# EAGLE board io-board-d-8 (EAGLE 8.4.3), part 1 of 2
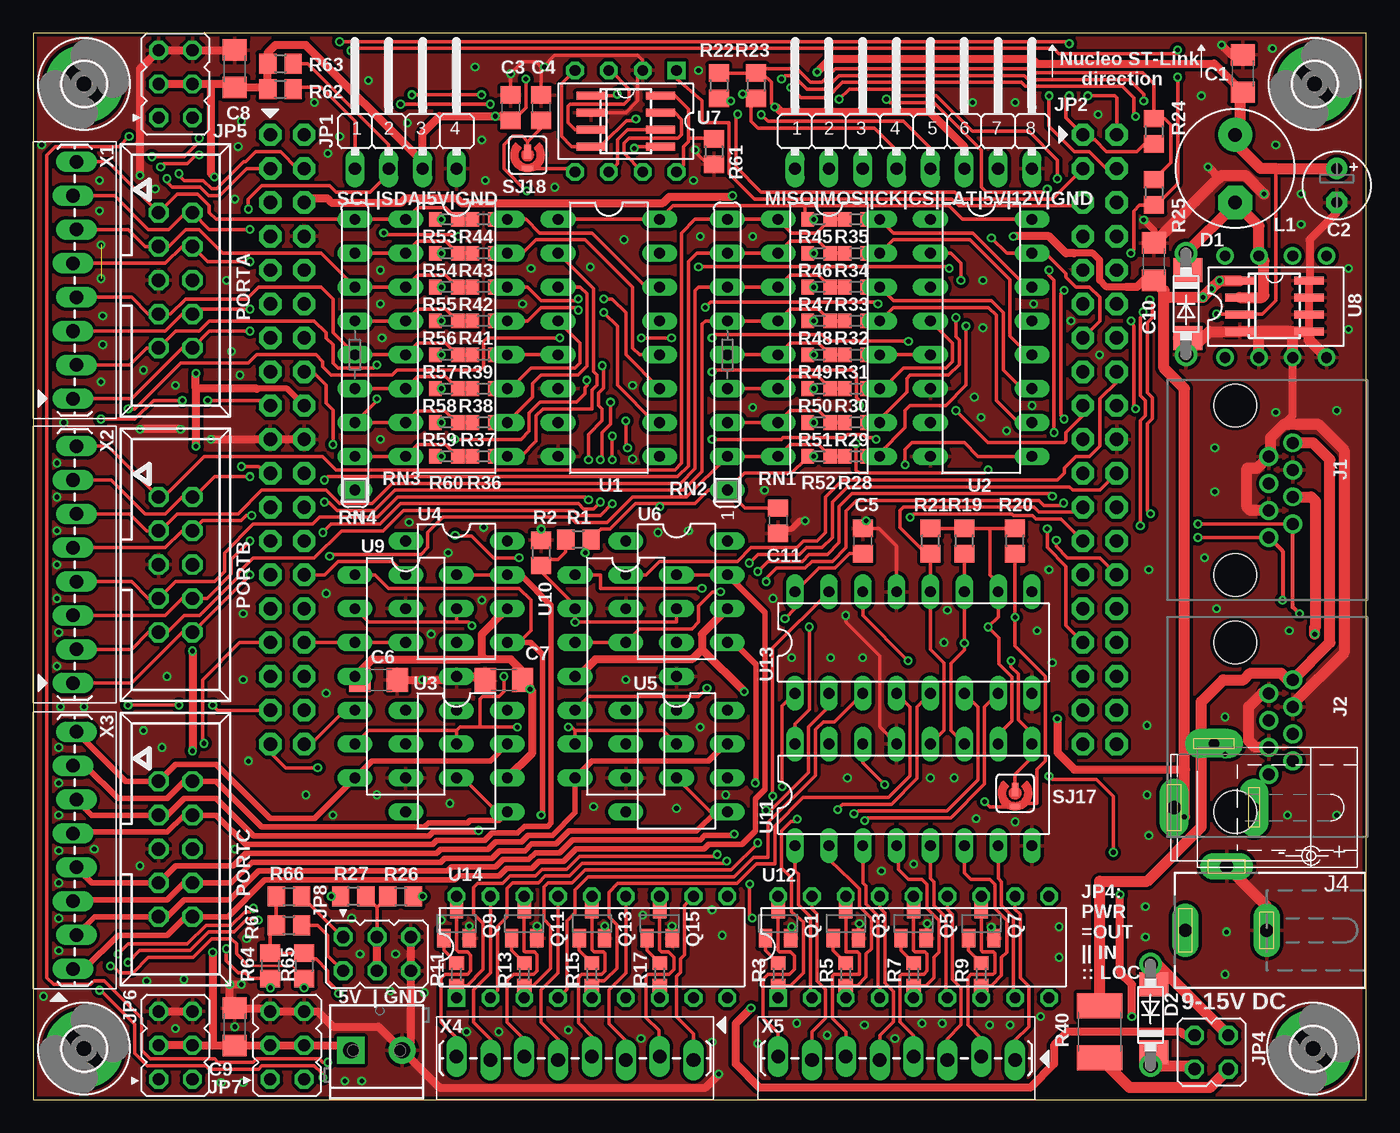
[diagram p5: board, top side]
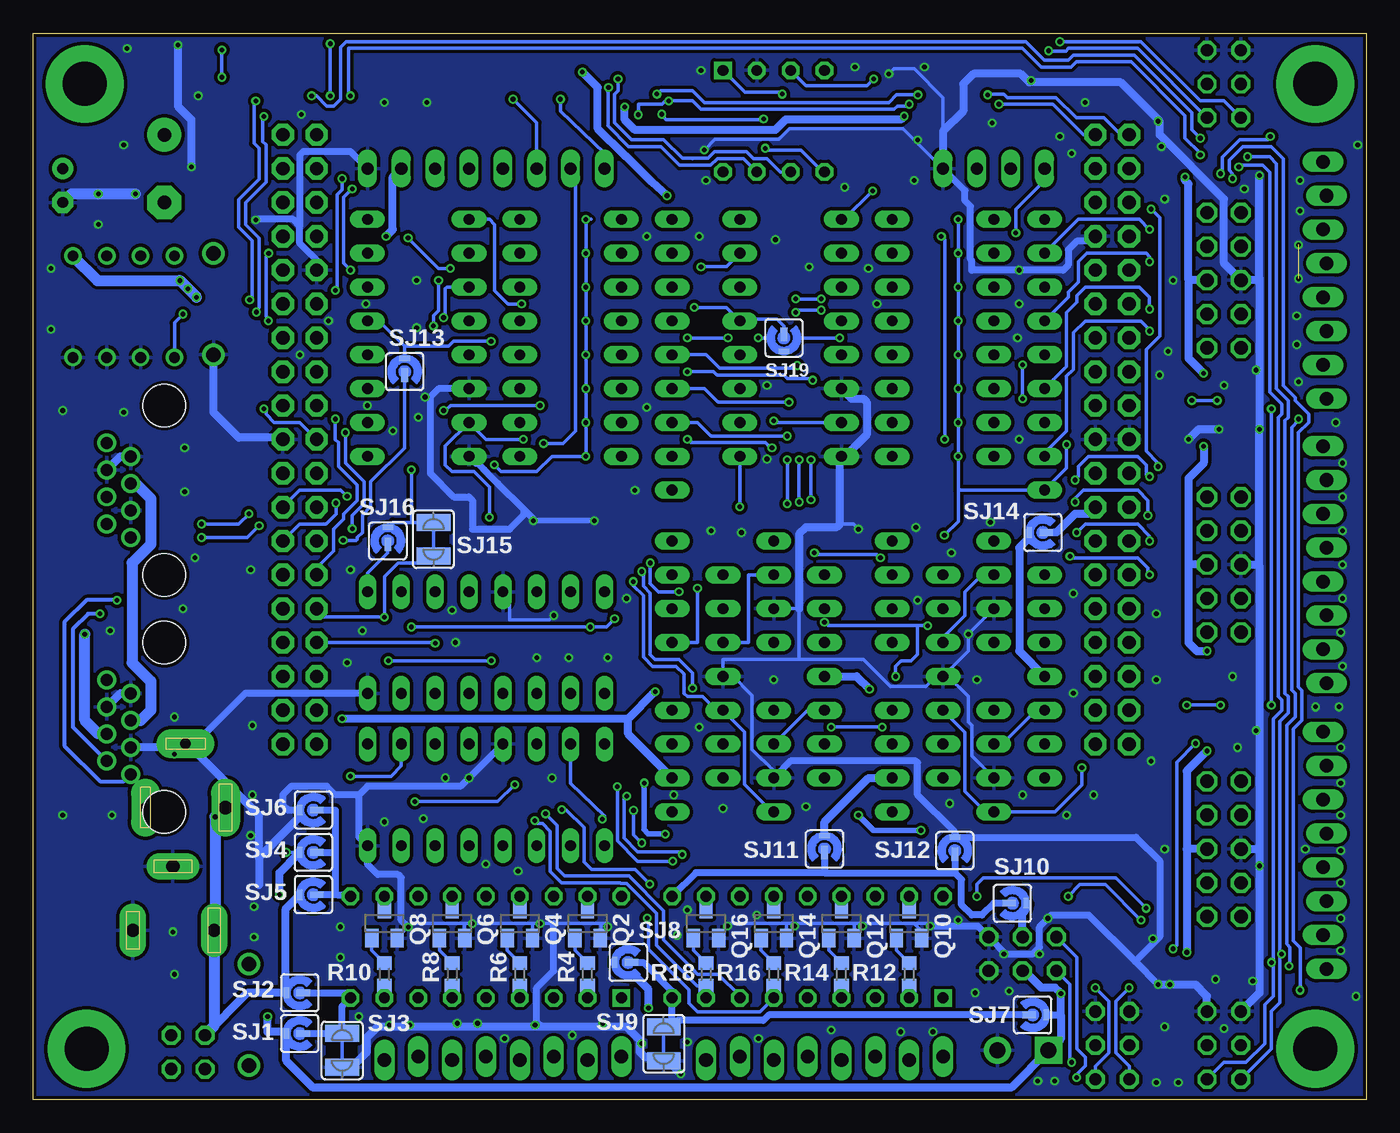
[diagram p6: board, bottom side, seen from below]

Size 100 x 80 mm. Coordinates in mm from the lower left corner, seen from the top.
Outline: 0,0 100,0 100,80 0,80 0,0
Copper layers (1*16): Top 0.035mm / dielectric 1.5mm / Bottom 0.035mm
Design rules "SeeedStudio_2layer_DRU_no_angle_20140221 *": minimum track width 6mil, minimum drill 12mil, track to track 10mil, track to pad 7mil, pad to pad 16mil, via to via 6mil, smd to smd 0mil, copper to edge 10mil, drill to drill 10mil, minimum pad ring 10mil, minimum via ring 6mil, stop-mask expansion 2mil, vias tented up to drill 100mil, thermal gap 10mil

## Footprints (pad centres in the part's own frame; a part is rotated, then mirrored left to right if it is on the bottom)
C1206 = smd 1.6 x 1.8: 1 -1.4,0; 2 1.4,0
E2,5-5 = drill 0.813 pad 1.6: + -1.27,0 | drill 0.813 pad 1.6 octagon: - 1.27,0
C0805 = smd 1.3 x 1.5: 1 -0.95,0; 2 0.95,0
DO41-7.6 = drill 1.1 pad 1.7: A 3.81,0; C -3.81,0
DO214AA-NODOC = smd 1.8 x 2.2: A 2.55,0; C -2.55,0
3,3-PAD = drill 3.3 pad 5.842: B3,3 0,0
RJ45-PULSE-E5J88 = drill 0.9 pad 1.422: 1 3.555,2.54; 2 2.535,4.32; 3 1.515,2.54; 4 0.495,4.32; 5 -0.495,2.54; 6 -1.515,4.32; 7 -2.535,2.54; 8 -3.555,4.32 | hole 3.2: 6.35,0; -6.35,0
DCJ0202 = drill 1 pad 2 long: 1 0,3.1; 2 4.8,0; 3 0,-3
SPC4077 = drill 0.8 pad 2.184 long: 1 -3,0; 2 0,-4.8 | drill 1 pad 2.184 long: 3 3,0
JP4F = drill 0.914 long: 1 -2.54,-1.27; 2 0,-1.27; 3 2.54,-1.27; 4 5.08,-1.27
JP8F = drill 0.914 long: 1 -8.89,0; 2 -6.35,0; 3 -3.81,0; 4 -1.27,0; 5 1.27,0; 6 3.81,0; 7 6.35,0; 8 8.89,0
JP2Q = drill 0.914 octagon: 1 -1.27,-1.27; 2 -1.27,1.27; 3 1.27,-1.27; 4 1.27,1.27
JP3Q = drill 0.914 octagon: 1 -2.54,-1.27; 2 -2.54,1.27; 3 0,-1.27; 4 0,1.27; 5 2.54,-1.27; 6 2.54,1.27
L5-8,5 = drill 1.016 pad 2.54: 1 -2.54,0 | drill 1.016 pad 2.54 octagon: 2 2.54,0
CON10M = drill 1 octagon: 1 -5.08,-1.27; 2 -5.08,1.27; 3 -2.54,-1.27; 4 -2.54,1.27; 5 0,-1.27; 6 0,1.27; 7 2.54,-1.27; 8 2.54,1.27; 9 5.08,-1.27; 10 5.08,1.27
SOT23 = smd 1 x 1.4: 1 -0.95,-1.1; 2 0.95,-1.1; 3 0,1.1
R0805 = smd 1.3 x 1.5: 1 -0.95,0; 2 0.95,0
R0603 = smd 1 x 1.1: 1 -0.85,0; 2 0.85,0
PTC1812 = smd 1.9 x 3.4: 1 -1.95,0; 2 1.95,0
R0603' = smd 0.95 x 1.1: 1 -0.825,0 | smd 1 x 1.1: 2 0.85,0
DIL16 = drill 0.813 long: 1 -8.89,-3.81; 2 -6.35,-3.81; 3 -3.81,-3.81; 4 -1.27,-3.81; 5 1.27,-3.81; 6 3.81,-3.81; 7 6.35,-3.81; 8 8.89,-3.81; 9 8.89,3.81; 10 6.35,3.81; 11 3.81,3.81; 12 1.27,3.81; 13 -1.27,3.81; 14 -3.81,3.81; 15 -6.35,3.81; 16 -8.89,3.81
SIL9 = drill 0.813 long: 1 -10.16,0; 2 -7.62,0; 3 -5.08,0; 4 -2.54,0; 5 0,0; 6 2.54,0; 7 5.08,0; 8 7.62,0; 9 10.16,0
SJ_RND2 = smd 1.016 x 0.508: P$1 -0.254,0 | smd 0.406 x 0.813: P$2 1.016,0
SJW-C = smd 1.27 x 2.54: 1 -1.27,0; 2 1.27,0
DIL08-LONG = drill 0.813 long: 1 -3.81,-3.81; 2 -1.27,-3.81; 3 1.27,-3.81; 4 3.81,-3.81; 5 3.81,3.81; 6 1.27,3.81; 7 -1.27,3.81; 8 -3.81,3.81
DIL08 = drill 0.813 square: 1 -3.81,-3.81 | drill 0.813 octagon: 2 -1.27,-3.81; 3 1.27,-3.81; 4 3.81,-3.81; 5 3.81,3.81; 6 1.27,3.81; 7 -1.27,3.81; 8 -3.81,3.81
SO-08 = smd 0.6 x 2.2: 1 -1.905,-2.6; 2 -0.635,-2.6; 3 0.635,-2.6; 4 1.905,-2.6; 5 1.905,2.6; 6 0.635,2.6; 7 -0.635,2.6; 8 -1.905,2.6
DIL08' = drill 0.813 pad 1.27: 1 -3.81,-3.81; 2 -1.27,-3.81; 3 1.27,-3.81; 4 3.81,-3.81; 5 3.81,3.81; 6 1.27,3.81; 7 -1.27,3.81; 8 -3.81,3.81
DIL14 = drill 0.813 long: 1 -7.62,-3.81; 2 -5.08,-3.81; 3 -2.54,-3.81; 4 0,-3.81; 5 2.54,-3.81; 6 5.08,-3.81; 7 7.62,-3.81; 8 7.62,3.81; 9 5.08,3.81; 10 2.54,3.81; 11 0,3.81; 12 -2.54,3.81; 13 -5.08,3.81; 14 -7.62,3.81
DIL18-THIN = drill 0.813 square: 1 -10.16,-3.81 | drill 0.813 octagon: 2 -7.62,-3.81; 3 -5.08,-3.81; 4 -2.54,-3.81; 5 0,-3.81; 6 2.54,-3.81; 7 5.08,-3.81; 8 7.62,-3.81; 9 10.16,-3.81; 10 10.16,3.81; 11 7.62,3.81; 12 5.08,3.81; 13 2.54,3.81; 14 0,3.81; 15 -2.54,3.81; 16 -5.08,3.81; 17 -7.62,3.81; 18 -10.16,3.81
NUCLEO_BRD_BASE64 = drill 1 pad 1.676 octagon: 3V3 2.54,27.94; 5V2 2.54,25.4; AGND 63.5,7.62; AVDD 60.96,38.1; BOOT0 0,38.1; E5V 2.54,40.64; GND3 0,22.86; GND4 2.54,20.32; GND5 2.54,22.86; GND6 2.54,38.1; GND7 60.96,35.56; GND8 63.5,22.86; IOREF2 2.54,33.02; NC1-PF7 0,33.02; NC2-PF6 0,35.56; NC3 2.54,15.24; NC4 2.54,35.56; NC5-PD8 63.5,35.56; NC6-PB11 63.5,25.4; NC7-PF5 63.5,2.54; NC8-PF4 63.5,0; NRESET 2.54,30.48; PA0 2.54,12.7; PA1 2.54,10.16; PA2 60.96,2.54; PA3 60.96,0; PA4 2.54,7.62; PA5 60.96,33.02; PA6 60.96,30.48; PA7 60.96,27.94; PA8 60.96,17.78; PA9 60.96,20.32; PA10 60.96,5.08; PA11 63.5,30.48; PA12 63.5,33.02; PA13 0,30.48; PA14 0,27.94; PA15 0,25.4; PB0 2.54,5.08; PB1 63.5,17.78; PB2 63.5,20.32; PB3 60.96,7.62; PB4 60.96,12.7; PB5 60.96,10.16; PB6 60.96,25.4; PB7 0,20.32; PB8 60.96,43.18; PB9 60.96,40.64; PB10 60.96,15.24; PB12 63.5,27.94; PB13 63.5,10.16; PB14 63.5,12.7; PB15 63.5,15.24; PC0 2.54,0; PC1 2.54,2.54; PC2 0,2.54; PC3 0,0; PC4 63.5,5.08; PC5 63.5,40.64; PC6 63.5,43.18; PC7 60.96,22.86; PC8 63.5,45.72; PC9 60.96,45.72; PC10 0,45.72; PC11 2.54,45.72; PC12 0,43.18; PC13 0,17.78; PC14 0,15.24; PC15 0,12.7; PD2 2.54,43.18; PF0-PH0 0,10.16; PF1-PH1 0,7.62; U5V 63.5,38.1; VBAT 0,5.08; VDD 0,40.64; VIN2 2.54,17.78
1X08_TERMINAL = drill 1.016 long: 1 0,0.127; 2 2.54,-0.127; 3 5.08,0.127; 4 7.62,-0.127; 5 10.16,0.127; 6 12.7,-0.127; 7 15.24,0.127; 8 17.78,-0.127
SCREWTERMINAL-3.5MM-2_LOCK = drill 1.2 pad 2.032 square: 1 -0.178,0 | drill 1.2 pad 2.032: 2 3.678,0

## Placement (x,y rotation side)
+12V  9-15V DC  [POWER_USAGE]  95.89,18.29 270 top
C1  [C1206]  90.73,76.99 90 top
C2  [E2,5-5]  97.79,68.58 270 top
C3  [C0805]  35.81,74.42 90 top
C4  [C0805]  38.1,74.42 90 top
C5  [C0805]  62.23,41.91 90 top
C6  [C1206]  25.91,31.5 0 top
C7  [C1206]  35.31,31.5 180 top
C8  [C1206]  15.11,77.34 90 top
C9  [C1206]  15.11,5.46 90 top
C10  [C1206]  84.07,62.87 90 top
C11  [C0805]  55.88,43.43 270 top
D1  [DO41-7.6]  86.49,59.69 270 top
D2  [DO41-7.6]  83.82,6.35 90 top
D3  DIODEDO-214AA-NODOC  [DO214AA-NODOC]  86.61,59.69 270 top
D4  DIODEDO-214AA-NODOC  [DO214AA-NODOC]  84.07,6.1 90 top
H1  [3,3-PAD]  3.81,76.2 0 top
H2  [3,3-PAD]  3.81,3.81 0 top
H3  [3,3-PAD]  96.01,3.81 0 top
H4  [3,3-PAD]  96.14,76.2 0 top
J1  RJ45-JACK  [RJ45-PULSE-E5J88]  90.17,45.72 270 top
J2  RJ45-JACK  [RJ45-PULSE-E5J88]  90.17,27.94 270 top
J3  DCJ0202  [DCJ0202]  89.53,12.7 90 top
J4  [SPC4077]  88.58,21.91 180 top
JP1  [JP4F]  26.67,71.12 0 top
JP2  JP8-FLAT  [JP8F]  66.04,69.85 0 top
JP4  [JP2Q]  88.39,3.56 0 top
JP5  [JP3Q]  10.67,76.2 90 top
JP6  [JP3Q]  10.67,4.06 90 top
JP7  [JP3Q]  19.05,4.06 90 top
JP8  [JP3Q]  25.78,10.92 0 top
L1  L-US  [L5-8,5]  90.17,69.85 270 top
PORTA  [CON10M]  10.67,61.47 270 top
PORTB  [CON10M]  10.67,40.13 270 top
PORTC  [CON10M]  10.67,18.8 270 top
Q1  [SOT23]  55.88,13.21 0 top
Q2  [SOT23]  58.42,13.21 0 bottom
Q3  [SOT23]  60.96,13.21 0 top
Q4  [SOT23]  63.5,13.21 0 bottom
Q5  [SOT23]  66.04,13.21 0 top
Q6  [SOT23]  68.58,13.21 0 bottom
Q7  [SOT23]  71.12,13.21 0 top
Q8  [SOT23]  73.66,13.21 0 bottom
Q9  [SOT23]  31.75,13.21 0 top
Q10  [SOT23]  34.29,13.21 0 bottom
Q11  [SOT23]  36.83,13.21 0 top
Q12  [SOT23]  39.37,13.21 0 bottom
Q13  [SOT23]  41.91,13.21 0 top
Q14  [SOT23]  44.45,13.21 0 bottom
Q15  [SOT23]  46.99,13.21 0 top
Q16  [SOT23]  49.53,13.21 0 bottom
R1  10k  [R0805]  40.89,42.04 0 top
R2  10k  [R0805]  38.1,41.02 270 top
R3  [R0603]  55.88,9.4 90 top
R4  [R0603]  58.42,9.4 90 bottom
R5  [R0603]  60.96,9.4 90 top
R6  [R0603]  63.5,9.4 90 bottom
R7  [R0603]  66.04,9.4 90 top
R8  [R0603]  68.58,9.4 90 bottom
R9  [R0603]  71.12,9.4 90 top
R10  [R0603]  73.66,9.4 90 bottom
R11  [R0603]  31.75,9.4 90 top
R12  [R0603]  34.29,9.4 90 bottom
R13  [R0603]  36.83,9.4 90 top
R14  [R0603]  39.37,9.4 90 bottom
R15  [R0603]  41.91,9.4 90 top
R16  [R0603]  44.45,9.4 90 bottom
R17  [R0603]  46.99,9.4 90 top
R18  [R0603]  49.53,9.4 90 bottom
R19  [R0805]  69.85,41.91 90 top
R20  [R0805]  73.66,41.91 90 top
R21  [R0805]  67.31,41.91 90 top
R22  [R0805]  51.44,76.07 270 top
R23  [R0805]  54.23,76.07 270 top
R24  [R0805]  84.07,72.64 270 top
R25  [R0805]  84.07,68.07 270 top
R26  [R0805]  27.56,15.24 0 top
R27  [R0805]  24,15.24 180 top
R28  [R0603]  61.72,48.26 180 top
R29  [R0603]  61.72,50.8 180 top
R30  [R0603]  61.72,53.34 180 top
R31  [R0603]  61.72,55.88 180 top
R32  [R0603]  61.72,58.42 180 top
R33  [R0603]  61.72,60.96 180 top
R34  [R0603]  61.72,63.5 180 top
R35  [R0603]  61.72,66.04 180 top
R36  [R0603]  33.78,48.26 180 top
R37  [R0603]  33.78,50.8 180 top
R38  [R0603]  33.78,53.34 180 top
R39  [R0603]  33.78,55.88 180 top
R40  500mA  [PTC1812]  80.01,5.08 90 top
R41  [R0603]  33.78,58.42 180 top
R42  [R0603]  33.78,60.96 180 top
R43  [R0603]  33.78,63.5 180 top
R44  [R0603]  33.78,66.04 180 top
R45  [R0603']  58.93,66.04 0 top
R46  [R0603']  58.93,63.5 0 top
R47  [R0603']  58.93,60.96 0 top
R48  [R0603']  58.93,58.42 0 top
R49  [R0603']  58.93,55.88 0 top
R50  [R0603']  58.93,53.34 0 top
R51  [R0603']  58.93,50.8 0 top
R52  [R0603']  58.93,48.26 0 top
R53  [R0603']  30.99,66.04 0 top
R54  [R0603']  30.99,63.5 0 top
R55  [R0603']  30.99,60.96 0 top
R56  [R0603']  30.99,58.42 0 top
R57  [R0603']  30.99,55.88 0 top
R58  [R0603']  30.99,53.34 0 top
R59  [R0603']  30.99,50.8 0 top
R60  [R0603']  30.99,48.26 0 top
R61  [R0805]  51.05,71.12 270 top
R62  [R0805]  18.54,75.82 0 top
R63  [R0805]  18.54,77.72 0 top
R64  [R0805]  17.78,10.03 270 top
R65  [R0805]  20.32,10.03 270 top
R66  [R0805]  19.18,15.24 0 top
R67  [R0805]  19.18,13.08 0 top
RN1  [DIL16]  59.69,57.15 270 top
RN2  10K  [SIL9]  52.07,55.88 90 top
RN3  [DIL16]  31.75,57.15 270 top
RN4  10K  [SIL9]  24.13,55.88 90 top
SJ1  [SJ_RND2]  80.01,4.95 180 bottom
SJ2  [SJ_RND2]  80.01,8 180 bottom
SJ3  [SJW-C]  76.83,3.68 270 bottom
SJ4  [SJ_RND2]  78.99,18.54 180 bottom
SJ5  [SJ_RND2]  78.99,15.37 180 bottom
SJ6  [SJ_RND2]  78.99,21.72 180 bottom
SJ7  [SJ_RND2]  25.02,6.35 0 bottom
SJ8  [SJ_RND2]  55.37,10.29 180 bottom
SJ9  [SJW-C]  52.7,4.19 270 bottom
SJ10  [SJ_RND2]  26.54,14.73 0 bottom
SJ11  [SJ_RND2]  40.64,18.8 90 bottom
SJ12  [SJ_RND2]  30.86,18.67 90 bottom
SJ13  [SJ_RND2]  72.14,54.61 90 bottom
SJ14  [SJ_RND2]  24.26,42.55 180 bottom
SJ15  [SJW-C]  69.98,42.04 90 bottom
SJ16  [SJ_RND2]  73.41,41.91 90 bottom
SJ17  [SJ_RND2]  73.66,22.99 270 top
SJ18  [SJ_RND2]  37.08,70.87 270 top
SJ19  [SJ_RND2]  43.69,57.15 270 bottom
U1  74HC166  [DIL16]  43.18,57.15 270 top
U2  74HC166  [DIL16]  71.12,57.15 270 top
U3  TC4426/28  [DIL08-LONG]  31.75,25.4 270 top
U4  TC4426/28  [DIL08-LONG]  31.75,38.1 270 top
U5  TC4426/28  [DIL08-LONG]  48.26,25.4 270 top
U6  TC4426/28  [DIL08-LONG]  48.26,38.1 270 top
U7  CAN-TXR-PDIP  [DIL08]  44.45,73.41 180 top
U7B  CAN-TXR-SO8  [SO-08]  44.45,73.41 270 top
U8  AP1509-50  [SO-08]  93.12,59.54 270 top
U8B  LM2574N-5.0  [DIL08']  93.22,59.49 0 top
U9  LM324N  [DIL14]  27.94,31.75 270 top
U10  LM324N  [DIL14]  44.45,31.75 270 top
U11  74AHCT595N  [DIL16]  66.04,22.86 0 top
U12  [DIL18-THIN]  66.04,11.43 0 top
U13  74AHCT595N  [DIL16]  66.04,34.29 0 top
U14  [DIL18-THIN]  41.91,11.43 0 top
U$1  NUCLEO_64_GENERIC  [NUCLEO_BRD_BASE64]  17.78,26.67 0 top
X1  M08-SCREW  [1X08_TERMINAL]  3.1,70.36 270 top
X2  M08-SCREW  [1X08_TERMINAL]  3.1,49.02 270 top
X3  M08-SCREW  [1X08_TERMINAL]  3.1,27.58 270 top
X4  PORTD  [1X08_TERMINAL]  31.75,3.1 0 top
X5  PORTE  [1X08_TERMINAL]  55.88,3.1 0 top
X6  [SCREWTERMINAL-3.5MM-2_LOCK]  24,3.68 0 top